# Altium schematic sheet WL-POWER.SchDoc
size 420 x 297 mm; Scale: 1:1; DocumentType: Схема электрическая принципиальная; FirstReferrence: UA3REO/R7KBI; DocumentNumber: 8; SheetNumber: 8; SheetTotal: 12
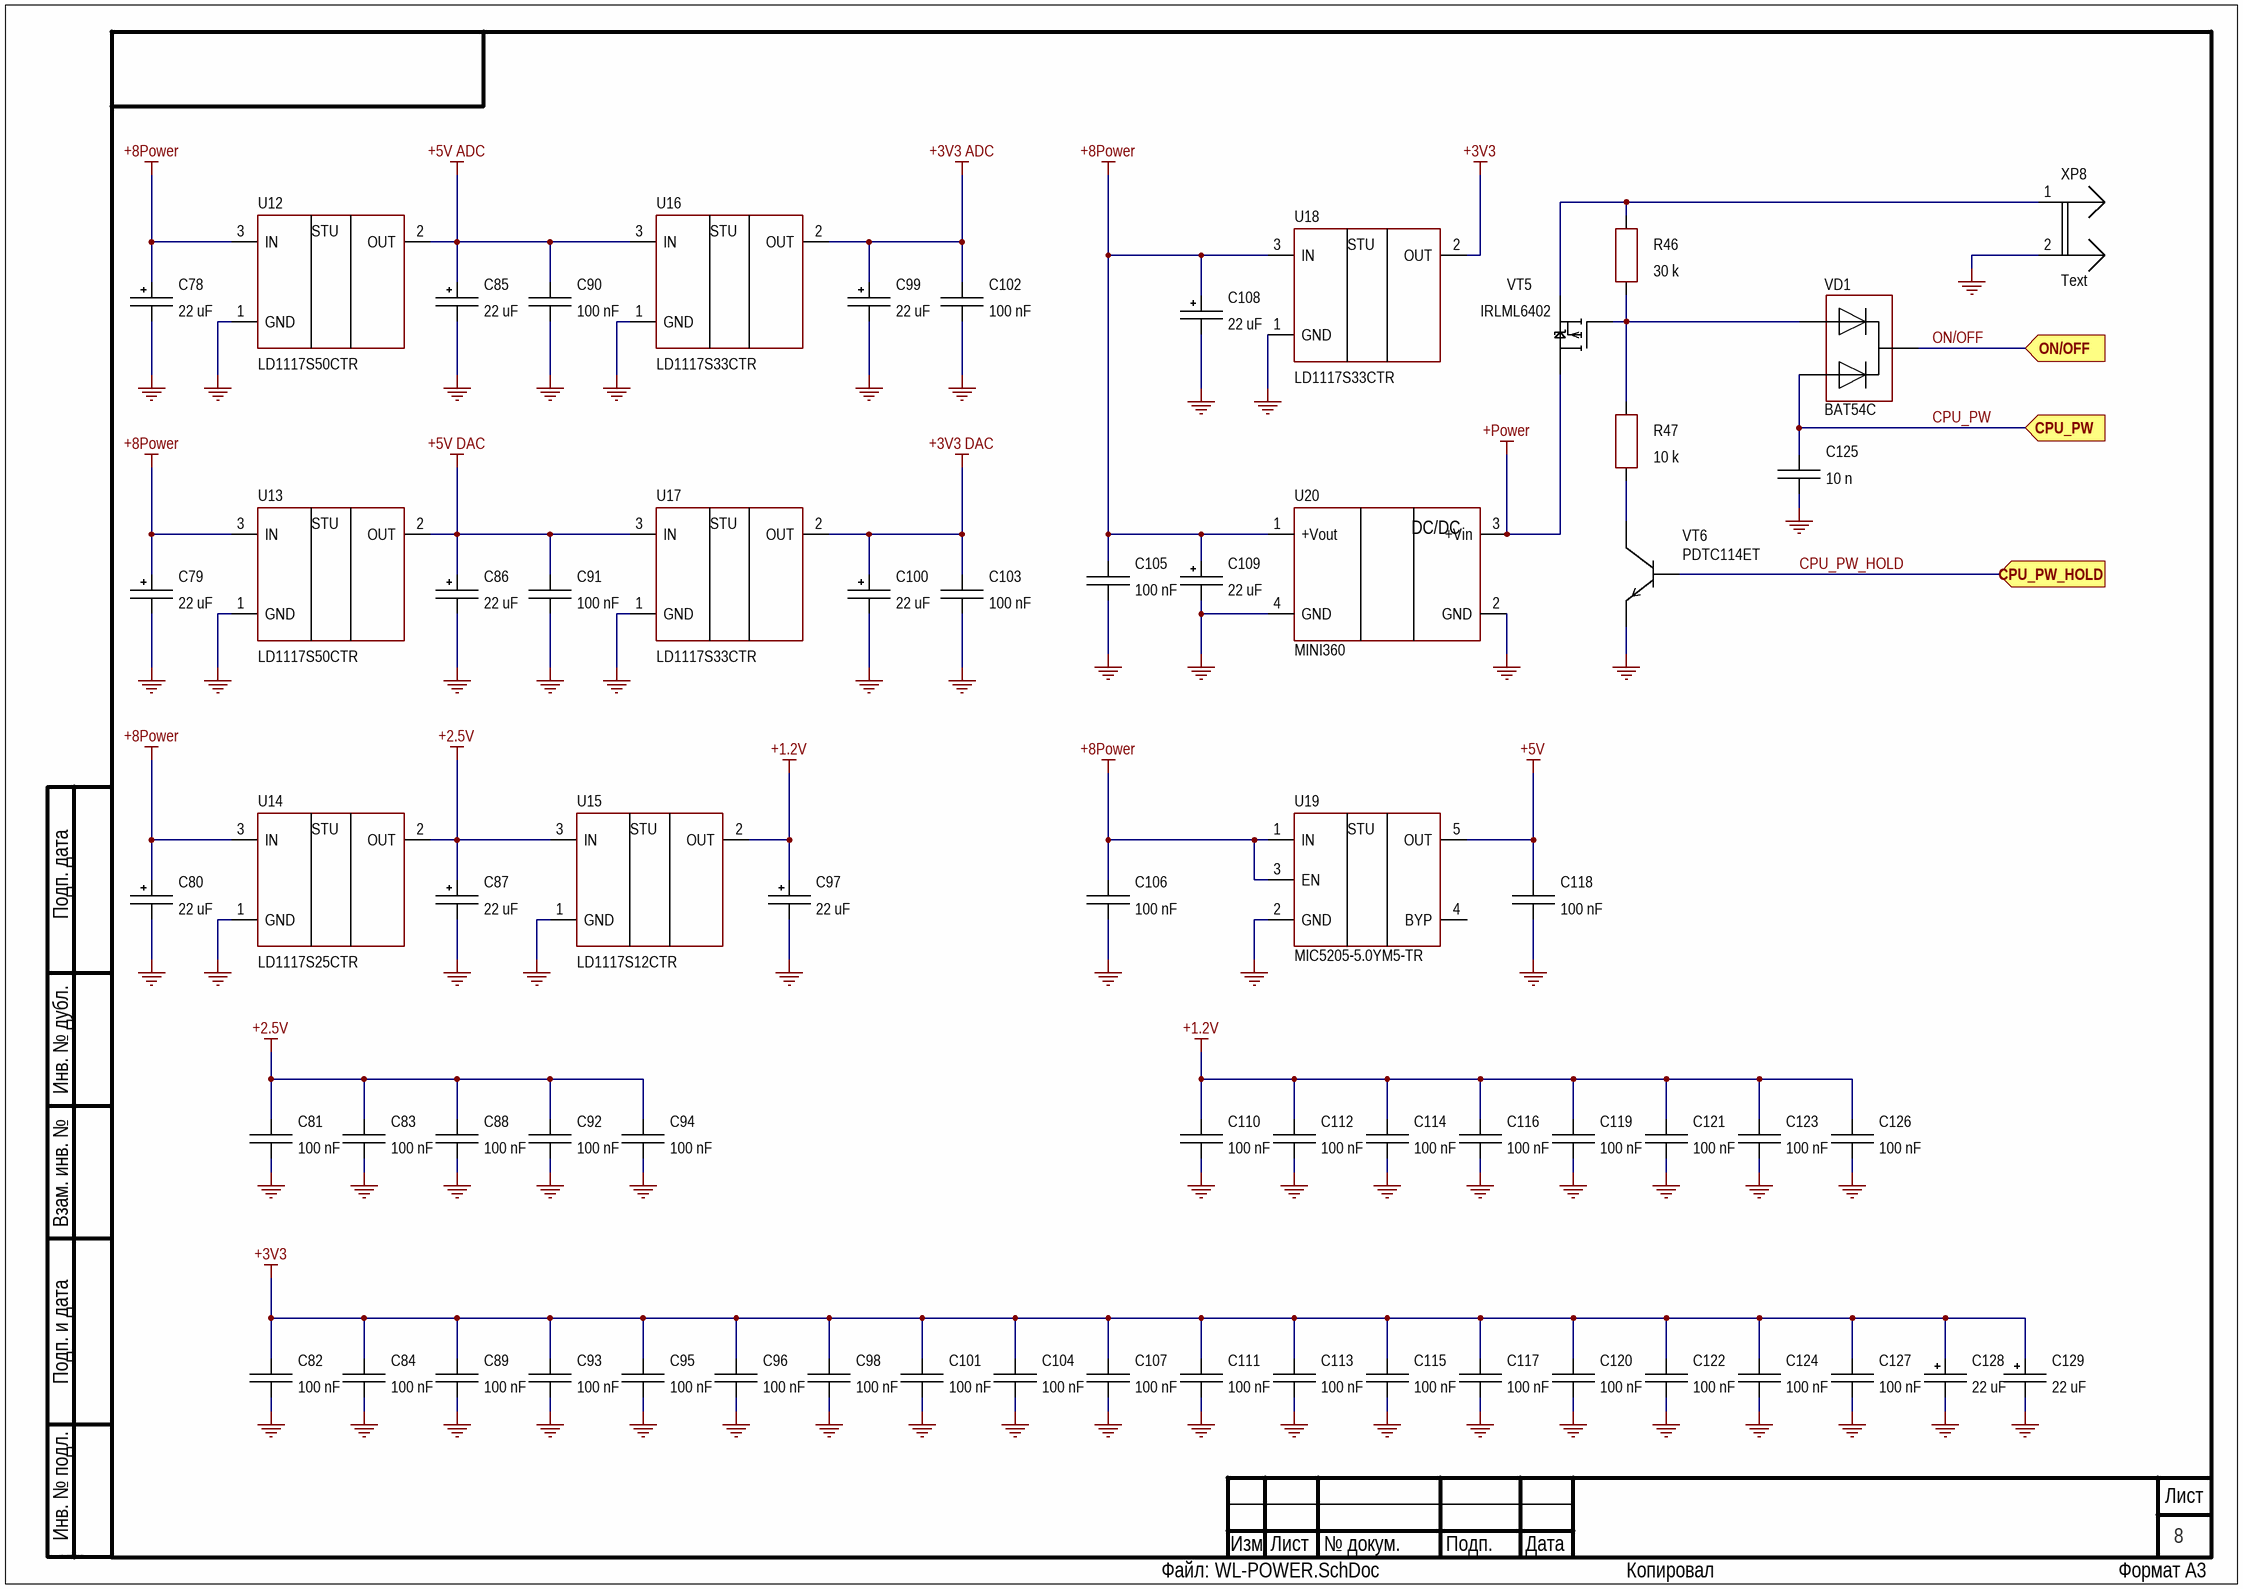
[diagram p0: WL-POWER.SchDoc]

## Parts
C78  22 uF  [CAP-CASE B]
C79  22 uF  [CAP-CASE B]
C80  22 uF  [CAP-CASE B]
C81  100 nF  [C-0805-0.95]
C82  100 nF  [C-0805-0.95]
C83  100 nF  [C-0805-0.95]
C84  100 nF  [C-0805-0.95]
C85  22 uF  [CAP-CASE B]
C86  22 uF  [CAP-CASE B]
C87  22 uF  [CAP-CASE B]
C88  100 nF  [C-0805-0.95]
C89  100 nF  [C-0805-0.95]
C90  100 nF  [C-0805-0.95]
C91  100 nF  [C-0805-0.95]
C92  100 nF  [C-0805-0.95]
C93  100 nF  [C-0805-0.95]
C94  100 nF  [C-0805-0.95]
C95  100 nF  [C-0805-0.95]
C96  100 nF  [C-0805-0.95]
C97  22 uF  [CAP-CASE B]
C98  100 nF  [C-0805-0.95]
C99  22 uF  [CAP-CASE B]
C100  22 uF  [CAP-CASE B]
C101  100 nF  [C-0805-0.95]
C102  100 nF  [C-0805-0.95]
C103  100 nF  [C-0805-0.95]
C104  100 nF  [C-0805-0.95]
C105  100 nF  [C-0805-0.95]
C106  100 nF  [C-0805-0.95]
C107  100 nF  [C-0805-0.95]
C108  22 uF  [CAP-CASE B]
C109  22 uF  [CAP-CASE B]
C110  100 nF  [C-0805-0.95]
C111  100 nF  [C-0805-0.95]
C112  100 nF  [C-0805-0.95]
C113  100 nF  [C-0805-0.95]
C114  100 nF  [C-0805-0.95]
C115  100 nF  [C-0805-0.95]
C116  100 nF  [C-0805-0.95]
C117  100 nF  [C-0805-0.95]
C118  100 nF  [C-0805-0.95]
C119  100 nF  [C-0805-0.95]
C120  100 nF  [C-0805-0.95]
C121  100 nF  [C-0805-0.95]
C122  100 nF  [C-0805-0.95]
C123  100 nF  [C-0805-0.95]
C124  100 nF  [C-0805-0.95]
C125  10 n  [C-0805-0.7]
C126  100 nF  [C-0805-0.95]
C127  100 nF  [C-0805-0.95]
C128  22 uF  [CAP-CASE B]
C129  22 uF  [CAP-CASE B]
R46  30 k  [R-0805]
R47  10 k  [R-0805]
U12  LD1117S50CTR  [SOT-223]
U13  LD1117S50CTR  [SOT-223]
U14  LD1117S25CTR  [SOT-223]
U15  LD1117S12CTR  [SOT-223]
U16  LD1117S33CTR  [SOT-223]
U17  LD1117S33CTR  [SOT-223]
U18  LD1117S33CTR  [SOT-223]
U19  MIC5205-5.0YM5-TR  [SOT-23-5]
U20  MINI360  [MINI360]
VD1  BAT54C  [SOT-23]
VT5  IRLML6402  [SOT-23]
VT6  PDTC114ET  [SOT-23]
XP8  Text  [61900211121]

## Ports
CPU_PW (in), CPU_PW_HOLD (in), ON/OFF (in)

## Nets
+1.2V: C97.1 C110.1 C112.1 C114.1 C116.1 C119.1 C121.1 C123.1 C126.1 U15.2(OUT)
+2.5V: C81.1 C83.1 C87.1 C88.1 C92.1 C94.1 U14.2(OUT) U15.3(IN)
+3V3: C82.1 C84.1 C89.1 C93.1 C95.1 C96.1 C98.1 C101.1 C104.1 C107.1 C111.1 C113.1 C115.1 C117.1 C120.1 C122.1 C124.1 C127.1 C128.1 C129.1 U18.2(OUT)
+3V3 ADC: C99.1 C102.2 U16.2(OUT)
+3V3 DAC: C100.1 C103.2 U17.2(OUT)
+5V: C118.1 U19.5(OUT)
+5V ADC: C85.1 C90.2 U12.2(OUT) U16.3(IN)
+5V DAC: C86.1 C91.2 U13.2(OUT) U17.3(IN)
+8Power: C78.1 C79.1 C80.1 C105.2 C106.1 C108.1 C109.1 U12.3(IN) U13.3(IN) U14.3(IN) U18.3(IN) U19.1(IN) U19.3(EN) U20.1(+Vout)
+Power: U20.3(+Vin) VT5.3(D)
GND: C78.2 C79.2 C80.2 C81.2 C82.2 C83.2 C84.2 C85.2 C86.2 C87.2 C88.2 C89.2 C90.1 C91.1 C92.2 C93.2 C94.2 C95.2 C96.2 C97.2 C98.2 C99.2 C100.2 C101.2 C102.1 C103.1 C104.2 C105.1 C106.2 C107.2 C108.2 C109.2 C110.2 C111.2 C112.2 C113.2 C114.2 C115.2 C116.2 C117.2 C118.2 C119.2 C120.2 C121.2 C122.2 C123.2 C124.2 C125.2 C126.2 C127.2 C128.2 C129.2 U12.1(GND) U13.1(GND) U14.1(GND) U15.1(GND) U16.1(GND) U17.1(GND) U18.1(GND) U19.2(GND) U20.2(GND) U20.4(GND) VT6.2 XP8.2
CPU_PW: C125.1 VD1.2 ; port CPU_PW
CPU_PW_HOLD: VT6.1 ; port CPU_PW_HOLD
ON/OFF: VD1.3 ; port ON/OFF
NetR46_1: R46.1 R47.1 VD1.1 VT5.1(G)
NetR46_2: R46.2 VT5.2(S) XP8.1
NetR47_2: R47.2 VT6.3

Not connected (* = marked no-connect by the designer): U19 4(BYP)

## Notes on the sheet
- Подп. дата
- Инв. № дубл.
- Взам. инв. №
- Подп. и дата
- Инв. № подл.
- Изм.
- Лист
- № докум.
- Подп.
- Дата
- ALTIUM GOSTBOM2.0 KEV
- Файл:
- Копировал
- Формат А3
- (in symbol LD1117S12CTR) STU
- (in symbol LD1117S25CTR) STU
- (in symbol LD1117S33CTR) STU
- (in symbol LD1117S50CTR) STU
- (in symbol MIC5205-5.0YM5-TR) STU

## Library data of the parts
C78-C80 C85-C87 C97 C99 C100 C108 C109 C128 C129 = EEE-1CA220WAR: Manufacturer: Panasonic Electronic Components; Type: Конденсатор; Value: 22; Tolerance: ±20%; Voltage: 16 V; CommentDOC: ( S - 16 V - 22  uF  ±20% ); Part Number: EEE-1CA220WAR; Units: uF; Case: 4x5.4; Operating Temperature: -40 ... 85 °C; Series: S; ValueSCH: 22 uF; ( Series - Voltage - Value  Units  Tolerance ): ( S - 16 V - 22  uF  ±20% )
C81-C84 C88-C96 C98 C101-C107 C110-C124 C126 C127 = CC0805KRX7R9BB104: Manufacturer: Yageo; Value: 100; Type: Конденсатор; Dielectric: X7R; Tolerance: ±10%; Voltage: 50 V; CommentDOC: ( CC - 0805 - X7R - 50 V - 100 nF ±10% ); Part Number: CC0805KRX7R9BB104; Units: nF; Case: 0805; Operating Temperature: -55 ... 125 °C; Series: CC; Value+Units: 100 nF; ValueSCH: 100 nF; ( Series - Case - Dielectric -  Voltage - Value+Units Tolerance: ( CC - 0805 - X7R - 50 V - 100 nF ±10% )
C125 = CC0805KRX7R9BB103: Manufacturer: Yageo; Value: 10; Type: Конденсатор; Dielectric: X7R; Units: nF; Tolerance: ±10%; Voltage: 50 V; Value+Units: 10 nF; CommentDOC: ( CC - 0805 - X7R - 50 V - 10 nF ±10% ); Part Number: CC0805KRX7R9BB103; Case: 0805; Operating Temperature: -55 ... 125 °C; Series: CC; ValueSCH: 10 n; ( Series - Case - Dielectric -  Voltage - Value+Units Tolerance: ( CC - 0805 - X7R - 50 V - 10 nF ±10% )
R46 = RC0805JR-0730KL: Manufacturer: Yageo; Value: 30; Power: 0,125 W; Units: kOhm; Tolerance: ±5%; Operating Voltage: 150 V; Value+Units: 30 kOhm; CommentDOC: ( RC - 0805 - 0,125 W - 30 kOhm  ±5% ); Type: Резистор; Part Number: RC0805JR-0730KL; Case: 0805; Operating Temperature: -55°C ... 155°C; ValueSCH: 30 k; Series: RC
R47 = RC0805JR-0710KL: Manufacturer: Yageo; Value: 10; Power: 0,125 W; Units: kOhm; Tolerance: ±5%; Operating Voltage: 150 V; Value+Units: 10 kOhm; CommentDOC: ( RC - 0805 - 0,125 W - 10 kOhm  ±5% ); Type: Резистор; Part Number: RC0805JR-0710KL; Case: 0805; Operating Temperature: -55°C ... 155°C; ValueSCH: 10 k; Series: RC
U12 U13 = LD1117S50CTR: IC REG LINEAR; Manufacturer: STMicroelectronics; Voltage Output: 5,0 V; Current Output Max: 800 mA; Voltage Input Max: 15 V; Type: Микросхема; Part Number: LD1117S50CTR; ValueSCH: LD1117S50CTR; Case: SOT-223; Operating Temperature: −40°C ... 125°C
U14 = LD1117S25CTR: IC REG LINEAR; Manufacturer: STMicroelectronics; Voltage Output: 2,5 V; Current Output Max: 800 mA; Voltage Input Max: 15 V; Type: Микросхема; Part Number: LD1117S25CTR; ValueSCH: LD1117S25CTR; Case: SOT-223; Operating Temperature: −40°C ... 125°C
U15 = LD1117S12CTR: IC REG LINEAR; Manufacturer: STMicroelectronics; Voltage Output: 1,2 V; Current Output Max: 800 mA; Voltage Input Max: 15 V; Type: Микросхема; Part Number: LD1117S12CTR; ValueSCH: LD1117S12CTR; Case: SOT-223; Operating Temperature: −40°C ... 125°C
U16-U18 = LD1117S33CTR: IC REG LINEAR; Manufacturer: STMicroelectronics; Voltage Output: 3,3 V; Current Output Max: 800 mA; Voltage Input Max: 15 V; Type: Микросхема; Part Number: LD1117S33CTR; ValueSCH: LD1117S33CTR; Case: SOT-223; Operating Temperature: −40°C ... 125°C
U19 = MIC5205-5.0YM5-TR: IC REG LINEAR  150MA SOT-23-5; Manufacturer: Microchip Technology; Voltage Output: 5,0 V; Voltage Input Max: 16 V; Type: Микросхема; Part Number: MIC5205-5.0YM5-TR; ValueSCH: MIC5205-5.0YM5-TR; Current Output Max: 150 mA; Case: SOT-23-5; Operating Temperature: −40°C ... 125°C
U20 = MINI360: DC/DC; Type: Модуль питания; Part Number: MINI360; ValueSCH: MINI360
VD1 = BAT54CLT3G: Manufacturer: ON Semiconductor; Type: Диод; Voltage Revers: 30 V; Current: 200 mA; Part Number: BAT54CLT3G; ValueSCH: BAT54C; Case: SOT-23; Operating Temperature: -40°С ... 150°С
VT5 = IRLML6402TRPBF: Manufacturer: Infineon Technologies; Type: Транзистор; D-S Voltage max: 20 V; Drain Current max: 3,7 A; Total Power Dissipation: 1,3 W; Rds On (Max): 65 mOhm; Vgs (Max): ±12 V; Gate Threshold Voltage: 1,2 V; Input Capacitance: 633 pF; Part Number: IRLML6402TRPBF; ValueSCH: IRLML6402; Operating Temperature: -55°C ... 150°C
VT6 = PDTC114ET,215: Manufacturer: Nexperia USA Inc.; Type: Транзистор; Total Power Dissipation: 250 mW; Uce max: 50 V; Ice max: 100 mA; F max: 230 MHz; Part Number: PDTC114ET,215; ValueSCH: PDTC114ET; Operating Temperature: -65°C …  150°C; DC Current Gain: -
XP8 = 61900211121: Manufacturer: Würth Elektronik; Pitch: 2,54 mm; Functional Analog: WF-2; Type: Вилка; Part Number: 61900211121; Series: WE-WTB; Number of Pins: 2; Operating Temperature: −40°C ... 105°C